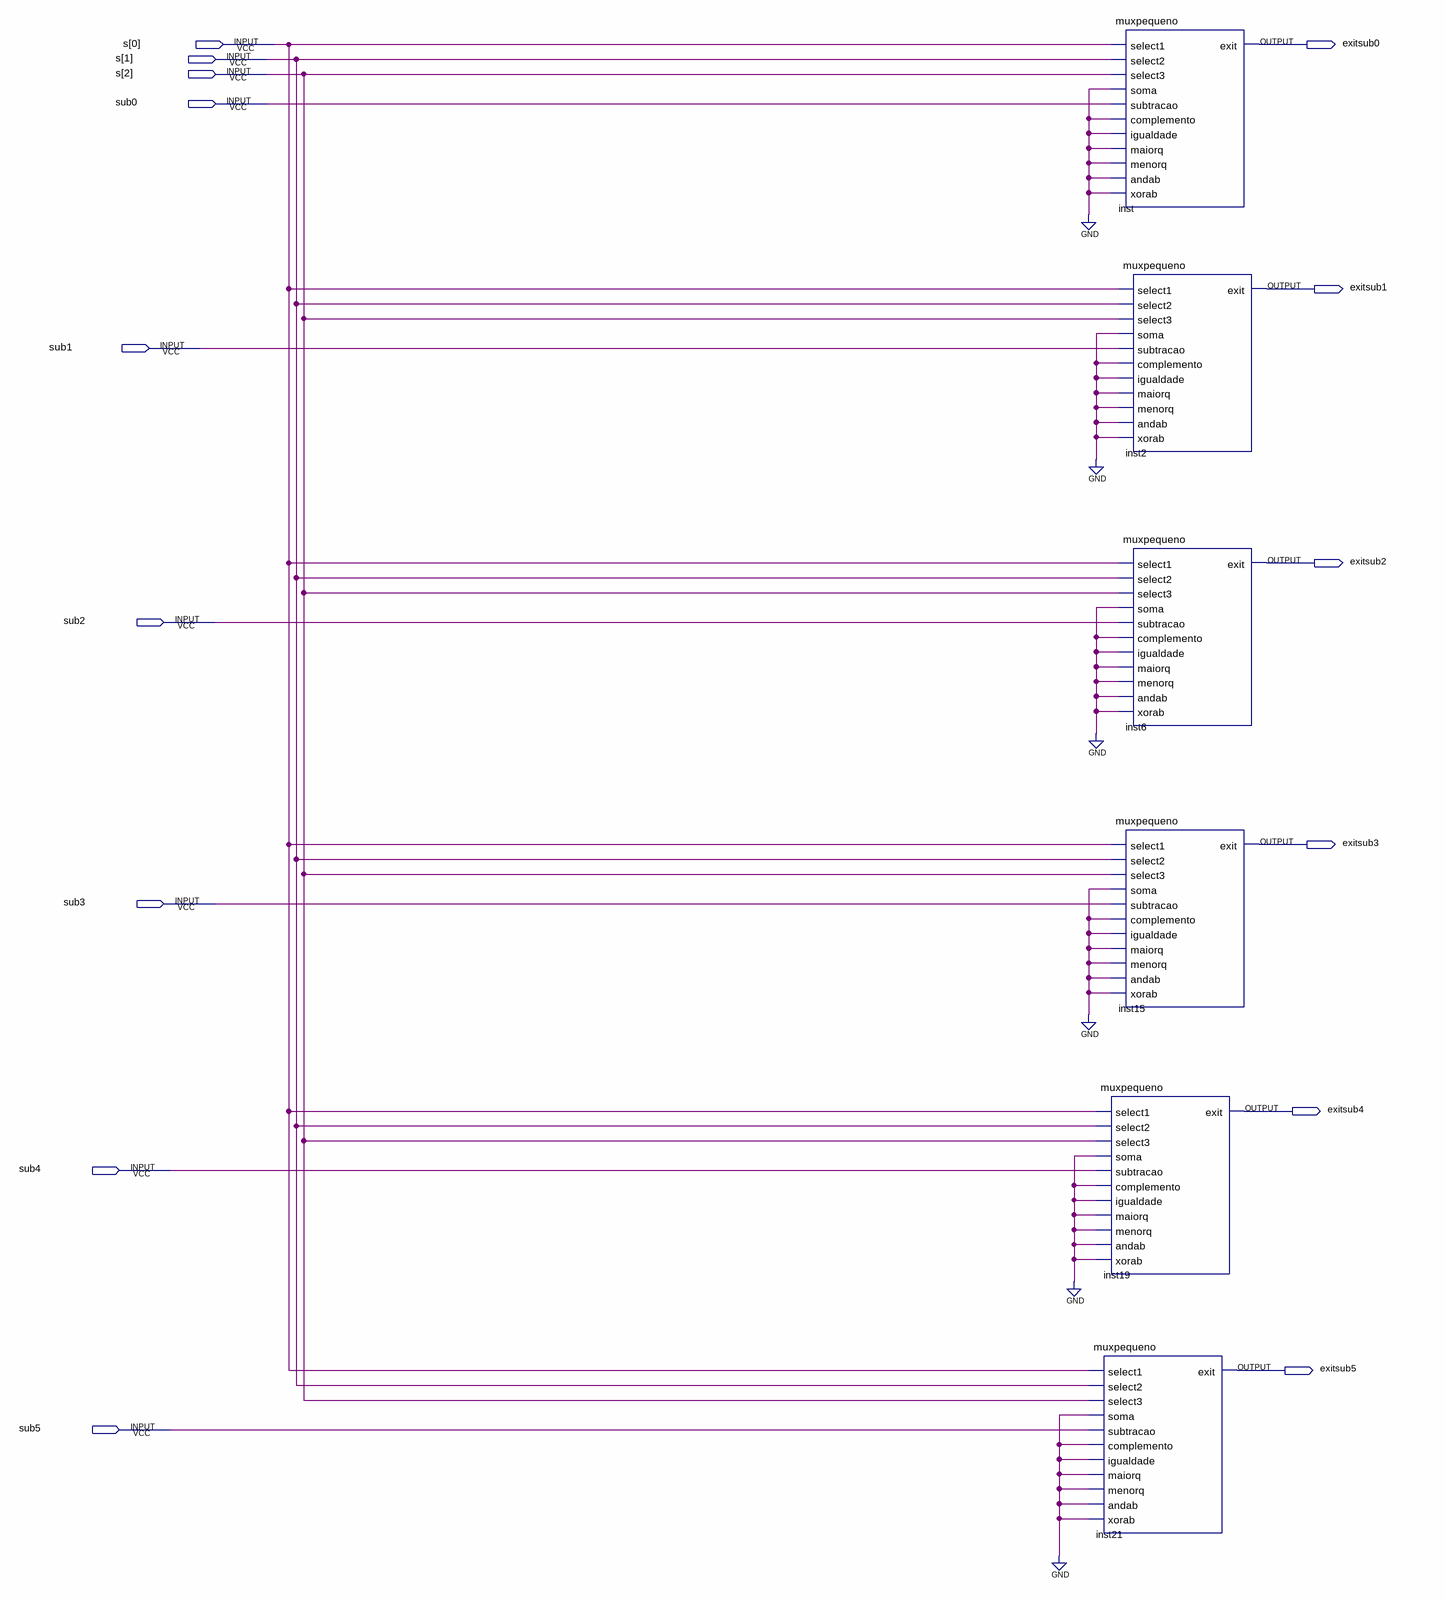
[diagram p0: schematic sheet]
// Quartus schematic muxsub.bdf as structural Verilog: 6 symbols, 15 pins
module muxsub (
  input  [2:0] s,
  input  sub0,
  input  sub1,
  input  sub2,
  input  sub3,
  input  sub4,
  input  sub5,
  output exitsub0,
  output exitsub1,
  output exitsub2,
  output exitsub3,
  output exitsub4,
  output exitsub5
);

  muxpequeno inst19 (
    .select1(s[0]), .select2(s[1]), .select3(s[2]), .soma(1'b0), .subtracao(sub4), .complemento(1'b0),
    .igualdade(1'b0), .maiorq(1'b0), .menorq(1'b0), .andab(1'b0), .xorab(1'b0), .exit(exitsub4));
  muxpequeno inst21 (
    .select1(s[0]), .select2(s[1]), .select3(s[2]), .soma(1'b0), .subtracao(sub5), .complemento(1'b0),
    .igualdade(1'b0), .maiorq(1'b0), .menorq(1'b0), .andab(1'b0), .xorab(1'b0), .exit(exitsub5));
  muxpequeno inst (
    .select1(s[0]), .select2(s[1]), .select3(s[2]), .soma(1'b0), .subtracao(sub0), .complemento(1'b0),
    .igualdade(1'b0), .maiorq(1'b0), .menorq(1'b0), .andab(1'b0), .xorab(1'b0), .exit(exitsub0));
  muxpequeno inst2 (
    .select1(s[0]), .select2(s[1]), .select3(s[2]), .soma(1'b0), .subtracao(sub1), .complemento(1'b0),
    .igualdade(1'b0), .maiorq(1'b0), .menorq(1'b0), .andab(1'b0), .xorab(1'b0), .exit(exitsub1));
  muxpequeno inst6 (
    .select1(s[0]), .select2(s[1]), .select3(s[2]), .soma(1'b0), .subtracao(sub2), .complemento(1'b0),
    .igualdade(1'b0), .maiorq(1'b0), .menorq(1'b0), .andab(1'b0), .xorab(1'b0), .exit(exitsub2));
  muxpequeno inst15 (
    .select1(s[0]), .select2(s[1]), .select3(s[2]), .soma(1'b0), .subtracao(sub3), .complemento(1'b0),
    .igualdade(1'b0), .maiorq(1'b0), .menorq(1'b0), .andab(1'b0), .xorab(1'b0), .exit(exitsub3));
endmodule
